# Altium schematic sheet MCUModule.SchDoc: Плата RF1-MCU
size 420 x 297 mm; ApprovedBy: Судаков; CheckedBy: Сарайкин; Author: Аршаница; CompanyName: ООО "ОКБ Вектор"; Address1: Address1; Address2: Address2; Address3: Address3; Address4: Address4; DocumentNumber: ВГАР.467846.009 Э3; SheetNumber: 1; SheetTotal: 2; Scale: 1:1; ProcessInspection: Казанов; NormInspection: Коваленко; FirstReferrence: ВГАР.467846.009
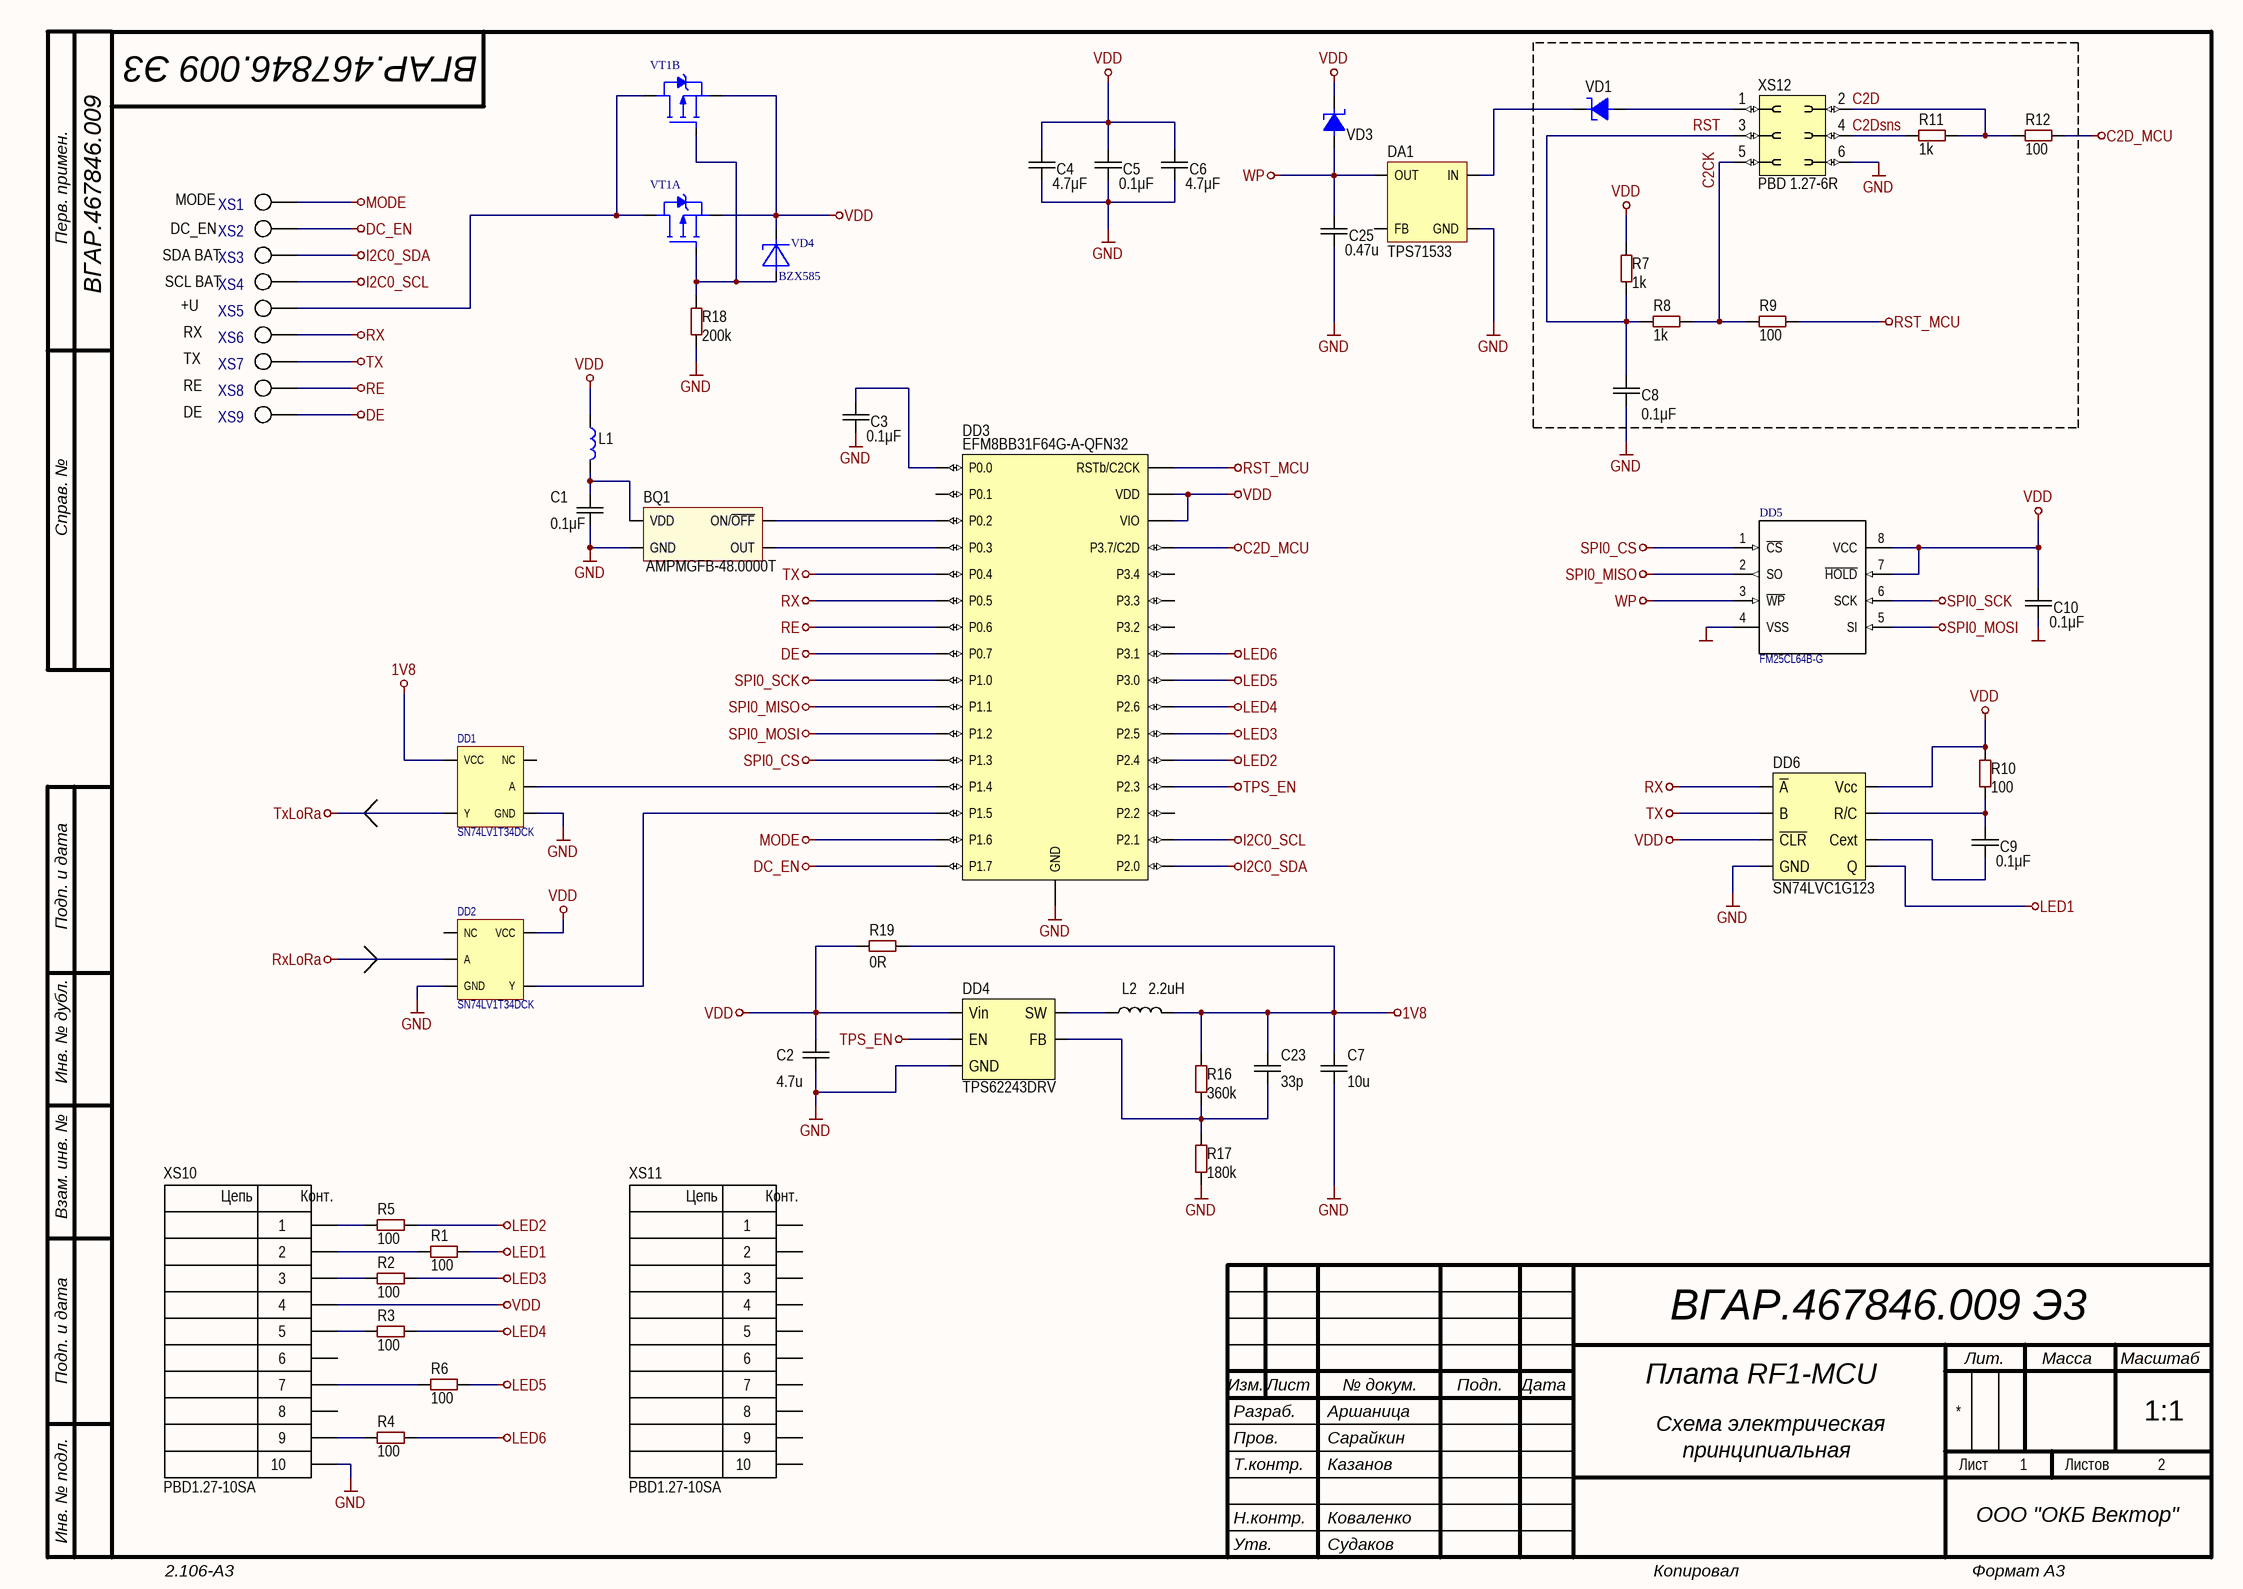
[diagram p0: MCUModule.SchDoc]

## Parts
BQ1  AMPMGFB-48.0000T  [AMPMGFB(1.6x1.2)]
C1  value 0.1μF  [CAP: 0603]
C2  value 4.7u  [CAP: 0603]
C3  value 0.1μF  [CAP: 0603]
C4  value 4.7μF  [CAP: 0603]
C5  value 0.1μF  [CAP: 0603]
C6  value 4.7μF  [CAP: 0603]
C7  value 10u  [CAP: 0603]
C8  value 0.1μF  [CAP: 0603]
C9  value 0.1μF  [CAP: 0603]
C10  value 0.1μF  [CAP: 0603]
C23  value 33p  [CAP: 0603]
C25  value 0.47u  [CAP: 0603]
DA1  TPS71533  [SC-70-5]
DD1  SN74LV1T34DCK  [SC70-5]
DD2  SN74LV1T34DCK  [SC70-5]
DD3  EFM8BB31F64G-A-QFN32  [32-QFN(4x4)]
DD4  TPS62243DRV  [SOT23-5]
DD5  FM25CL64B-G  [SO-8_N]
DD6  SN74LVC1G123  [8-VSSOP]
L1  BLM18AG102SN1D  [IND: 0603]  (value not drawn)
L2  value 2.2uH  [VLF302515MT]  (hidden comment: VLF302515MT)
R1  value 100  [RES: 0603]
R2  value 100  [RES: 0603]
R3  value 100  [RES: 0603]
R4  value 100  [RES: 0603]
R5  value 100  [RES: 0603]
R6  value 100  [RES: 0603]
R7  value 1k  [RES: 0603]
R8  value 1k  [RES: 0603]
R9  value 100  [RES: 0603]
R10  value 100  [RES: 0603]
R11  value 1k  [RES: 0603]
R12  value 100  [RES: 0603]
R16  value 360k  [RES: 0603]
R17  value 180k  [RES: 0603]
R18  value 200k  [RES: 0603]
R19  value 0R  [RES: 0402]
VD1  (no value)  [DIODE: SOD523]
VD3  (no value)  [DIODE: SOD523]
VD4  BZX585  [SOD523]
VT1  BSS84AKS  [SC-70-6]  (value not drawn)  (parts A,B of 2)
XS1  Testpoint_HS1mm  [TestPoint(without 3D)]  (value not drawn)
XS2  Testpoint_HS1mm  [TestPoint(without 3D)]  (value not drawn)
XS3  Testpoint_HS1mm  [TestPoint(without 3D)]  (value not drawn)
XS4  Testpoint_HS1mm  [TestPoint(without 3D)]  (value not drawn)
XS5  Testpoint_HS1mm  [TestPoint(without 3D)]  (value not drawn)
XS6  Testpoint_HS1mm  [TestPoint(without 3D)]  (value not drawn)
XS7  Testpoint_HS1mm  [TestPoint(without 3D)]  (value not drawn)
XS8  Testpoint_HS1mm  [TestPoint(without 3D)]  (value not drawn)
XS9  Testpoint_HS1mm  [TestPoint(without 3D)]  (value not drawn)
XS10  PBD1.27-10SA  [CON: PBD-10-1.27S]
XS11  PBD1.27-10SA  [CON: PBD-10-1.27S]
XS12  PBD 1.27-6R  [CON: PBD1.27-6]

## Nets
1V8: C7.2 C23.2 DD1.5(VCC) L2.2 R16.1 R19.2
C2D_MCU: DD3.5(P3.7/C2D) R12.1
DC_EN: DD3.18(P1.7) XS2.1
DE: DD3.26(P0.7) XS9.1
GND: BQ1.2(GND) C1.1 C2.1 C3.1 C4.1 C5.1 C6.1 C7.1 C8.1 C10.1 C25.1 DA1.2(GND) DD1.3(GND) DD2.3(GND) DD3.0(GND) DD4.2(GND) DD5.4(VSS) DD6.4(GND) R17.2 R18.2 XS10.10 XS12.6
I2C0_SCL: DD3.16(P2.1) XS4.1
I2C0_SDA: DD3.17(P2.0) XS3.1
LED1: DD6.5(Q) R1.2
LED2: DD3.13(P2.4) R5.2
LED3: DD3.12(P2.5) R2.2
LED4: DD3.11(P2.6) R3.2
LED5: DD3.10(P3.0) R6.2
LED6: DD3.9(P3.1) R4.2
MODE: DD3.19(P1.6) XS1.1
RE: DD3.27(P0.6) XS8.1
RST_MCU: DD3.4(RSTb/C2CK) R9.2
RX: DD3.28(P0.5) DD6.1(~{A}) XS6.1
RxLoRa: DD2.2(A)
SPI0_CS: DD3.22(P1.3) DD5.1(~{CS})
SPI0_MISO: DD3.24(P1.1) DD5.2(SO)
SPI0_MOSI: DD3.23(P1.2) DD5.5(SI)
SPI0_SCK: DD3.25(P1.0) DD5.6(SCK)
TPS_EN: DD3.14(P2.3) DD4.3(EN)
TX: DD3.29(P0.4) DD6.2(B) XS7.1
TxLoRa: DD1.4(Y)
VDD: C2.2 C4.2 C5.2 C6.2 C10.2 DD2.5(VCC) DD3.2(VIO) DD3.3(VDD) DD4.1(Vin) DD5.7(~{HOLD}) DD5.8(VCC) DD6.3(~{CLR}) DD6.8(Vcc) L1.1 R7.1 R10.1 R19.1 VD3.2 VD4.1(C) VT1.1(S1) VT1.4(S2) XS10.4
WP: C25.2 DA1.5(OUT) DD5.3(~{WP}) VD3.1
C2CK: R8.2 R9.1 XS12.5
C2D: R11.2 R12.2 XS12.2
C2Dsns: R11.1 XS12.4
RST: C8.2 R7.2 R8.1 XS12.3
NetBQ1_1: BQ1.1(ON/~{OFF}) DD3.31(P0.2)
NetBQ1_3: BQ1.3(OUT) DD3.30(P0.3)
NetBQ1_4: BQ1.4(VDD) C1.2 L1.2
NetC3_2: C3.2 DD3.1(P0.0)
NetC9_1: C9.1 DD6.6(Cext)
NetC9_2: C9.2 DD6.7(R/C) R10.2
NetC23_1: C23.1 DD4.4(FB) R16.2 R17.1
NetDA1_4: DA1.4(IN) VD1.2
NetDD1_2: DD1.2(A) DD3.21(P1.4)
NetDD2_4: DD2.4(Y) DD3.20(P1.5)
NetDD4_5: DD4.5(SW) L2.1
NetR1_1: R1.1 XS10.2
NetR2_1: R2.1 XS10.3
NetR3_1: R3.1 XS10.5
NetR4_1: R4.1 XS10.9
NetR5_1: R5.1 XS10.1
NetR6_1: R6.1 XS10.7
NetR18_1: R18.1 VD4.2(A) VT1.2(G1) VT1.5(G2)
NetVD1_1: VD1.1 XS12.1
NetVT1_3: VT1.3(D2) VT1.6(D1) XS5.1

Not connected (* = marked no-connect by the designer): DA1 1(FB); DD1 1(NC); DD2 1(NC); DD3 6(P3.4) 7(P3.3) 8(P3.2) 15(P2.2) 32(P0.1); XS10 6 8; XS11 1 2 3 4 5 6 7 8 9 10

## Notes on the sheet
- Рабочее подключение программатора.
  Можно портировать в другие проекты.
  На плате не правильно установлен R11.
- SDA BAT
- DC_EN
- MODE
- SCL BAT
- +U
- RX
- TX
- RE
- DE
- Схема электрическая
- принципиальная
- Перв. примен.
- Справ. №
- Подп. и дата
- Инв. № дубл.
- Взам. инв. №
- Разраб.
- Изм.
- Лист
- № докум.
- Подп.
- Дата
- Лит.
- Масса
- Масштаб
- Пров.
- Т.контр.
- Листов
- Инв. № подл.
- Утв.
- Н.контр.
- 2.106-A3
- Копировал
- Формат А3
- (in symbol PBD1.27-10SA) Цепь; Конт.

## Library data of the parts
C1 C3 C5 C8-C10 = Ceramic_0603: Manufacturer: Yageo; PartNumber: CC0603KRX7R7BB104; ValueManufacturerPartNumber: Ceramic capacitor, 0.1μF, X7R, ±10%, 16V, 0603, -55...+125°C; TypeCapacitor: Ceramic capacitor; Tolerance: ±10%; TypeDielectric: X7R; Voltage: 16V; Package: 0603; HelpURL: https://www.digikey.com/product-detail/en/yageo/CC0603KRX7R7BB104/311-1088-1-ND/302998; Temperature: -55...+125°C
C2 = Ceramic_0603: Manufacturer: Yageo; PartNumber: CC0603KRX7R7BB104; ValueManufacturerPartNumber: Ceramic capacitor, 4.7u, X7R, ±10%, 16V, 0603, -55...+125°C; TypeCapacitor: Ceramic capacitor; Tolerance: ±10%; TypeDielectric: X7R; Voltage: 16V; Package: 0603; HelpURL: https://www.digikey.com/product-detail/en/yageo/CC0603KRX7R7BB104/311-1088-1-ND/302998; Temperature: -55...+125°C
C4 C6 = Ceramic_0603: Manufacturer: Yageo; PartNumber: CC0603KRX7R7BB104; ValueManufacturerPartNumber: Ceramic capacitor, 4.7μF, X7R, ±10%, 16V, 0603, -55...+125°C; TypeCapacitor: Ceramic capacitor; Tolerance: ±10%; TypeDielectric: X7R; Voltage: 16V; Package: 0603; HelpURL: https://www.digikey.com/product-detail/en/yageo/CC0603KRX7R7BB104/311-1088-1-ND/302998; Temperature: -55...+125°C
C7 = Ceramic_0603: Manufacturer: Yageo; PartNumber: CC0603KRX7R7BB104; ValueManufacturerPartNumber: Ceramic capacitor, 10u, X7R, ±10%, 16V, 0603, -55...+125°C; TypeCapacitor: Ceramic capacitor; Tolerance: ±10%; TypeDielectric: X7R; Voltage: 16V; Package: 0603; HelpURL: https://www.digikey.com/product-detail/en/yageo/CC0603KRX7R7BB104/311-1088-1-ND/302998; Temperature: -55...+125°C
C23 = Ceramic_0603: Manufacturer: Yageo; PartNumber: CC0603KRX7R7BB104; ValueManufacturerPartNumber: Ceramic capacitor, 33p, X7R, ±10%, 16V, 0603, -55...+125°C; TypeCapacitor: Ceramic capacitor; Tolerance: ±10%; TypeDielectric: X7R; Voltage: 16V; Package: 0603; HelpURL: https://www.digikey.com/product-detail/en/yageo/CC0603KRX7R7BB104/311-1088-1-ND/302998; Temperature: -55...+125°C
C25 = Ceramic_0603: Manufacturer: Yageo; PartNumber: CC0603KRX7R7BB104; ValueManufacturerPartNumber: Ceramic capacitor, 0.47u, X7R, ±10%, 16V, 0603, -55...+125°C; TypeCapacitor: Ceramic capacitor; Tolerance: ±10%; TypeDielectric: X7R; Voltage: 16V; Package: 0603; HelpURL: https://www.digikey.com/product-detail/en/yageo/CC0603KRX7R7BB104/311-1088-1-ND/302998; Temperature: -55...+125°C
DA1 = TPS71501: Микросхема; Manufacturer: Texas Instruments; ComponentLink1Description: Data Sheet
DD1 DD2 = SN74LV1T34DCK: Single Buffer; ComponentLink1Description: Datasheet; ComponentLink1URL: https://www.ti.com/lit/ds/symlink/sn74lv1t34.pdf?ts=1607003293244&ref_url=https%253A%252F%252Fwww.ti.com%252Fproduct%252FSN74LV1T34
DD3 = EFM8BB31F64G-A-QFN32: 8051 MCU Core
DD4 = TPS62243DRV: Step-down converter 300mA
DD5 = FM25CL64B-G: Микросхема; ReplacementPart1Manufacturer: ISSI; ReplacementPart1PartNumber: IS25C08-2ZLI-TR; ComponentLink1Description: Manufacturer Link; ComponentLink1URL: http://www.microchip.com; ComponentLink2Description: Datasheet; ComponentLink3Description: Packaging Specification; PartNumber: FM25CL64B-G; Manufacturer: FM25CL64B-G
DD6 = SN74LVC1G123: Monostable Multivibrator / With Schmitt-Trigger Inputs; ComponentLink1Description: Datasheet; ComponentLink1URL: https://www.ti.com/lit/ds/symlink/sn74lvc1g123.pdf?ts=1636961729203&ref_url=https%253A%252F%252Fwww.google.com%252F
L1 = BLM18AG102SN1D: 100MHz 1K
R1-R6 R9 R10 R12 = Resistor_0603: Manufacturer: Yageo; PartNumber: RC0603JR-07100RL; ValueManufacturerPartNumber: Resistor film, 100, ±5%, 0603, 0.1W, -55...+125°C; TypeResistor: Resistor film; Power: 0.1W; Tolerance: ±5%; Package: 0603; HelpURL: https://www.digikey.com/product-detail/en/yageo/RC0603JR-07100RL/311-100GRCT-ND/729644; Temperature: -55...+125°C
R7 R8 R11 = Resistor_0603: Manufacturer: Yageo; PartNumber: RC0603JR-07100RL; ValueManufacturerPartNumber: Resistor film, 1k, ±5%, 0603, 0.1W, -55...+125°C; TypeResistor: Resistor film; Power: 0.1W; Tolerance: ±5%; Package: 0603; HelpURL: https://www.digikey.com/product-detail/en/yageo/RC0603JR-07100RL/311-100GRCT-ND/729644; Temperature: -55...+125°C
R16 = Resistor_0603: Manufacturer: Yageo; PartNumber: RC0603JR-07100RL; ValueManufacturerPartNumber: Resistor film, 360k, ±5%, 0603, 0.1W, -55...+125°C; TypeResistor: Resistor film; Power: 0.1W; Tolerance: ±5%; Package: 0603; HelpURL: https://www.digikey.com/product-detail/en/yageo/RC0603JR-07100RL/311-100GRCT-ND/729644; Temperature: -55...+125°C
R17 = Resistor_0603: Manufacturer: Yageo; PartNumber: RC0603JR-07100RL; ValueManufacturerPartNumber: Resistor film, 180k, ±5%, 0603, 0.1W, -55...+125°C; TypeResistor: Resistor film; Power: 0.1W; Tolerance: ±5%; Package: 0603; HelpURL: https://www.digikey.com/product-detail/en/yageo/RC0603JR-07100RL/311-100GRCT-ND/729644; Temperature: -55...+125°C
R18 = Resistor_0603: Manufacturer: Yageo; PartNumber: RC0603JR-07100RL; ValueManufacturerPartNumber: Resistor film, 200k, ±5%, 0603, 0.1W, -55...+125°C; TypeResistor: Resistor film; Power: 0.1W; Tolerance: ±5%; Package: 0603; HelpURL: https://www.digikey.com/product-detail/en/yageo/RC0603JR-07100RL/311-100GRCT-ND/729644; Temperature: -55...+125°C
R19 = Resistor_0402: Manufacturer: Yageo; PartNumber: RC0402JR-07100RL; ValueManufacturerPartNumber: Resistor film, 0R, ±5%, 0402, 0.063W, -55...+125°C; TypeResistor: Resistor film; Power: 0.063W; Tolerance: ±5%; Package: 0402; HelpURL: https://www.digikey.com/product-detail/en/yageo/RC0402JR-07100RL/311-100JRCT-ND/729362; Temperature: -55...+125°C
VD1 VD3 = Schottky_single: Manufacturer: Diodes Incorporated; ValueManufacturerPartNumber: Schottky diode, 80V, 500mA, 1V, 15pF, SOD-123, -55...+150°C; PartNumber: BAT54XV2; TypeDiode: Schottky diode; Voltage: 80V; Current: 500mA; VoltageDrop: 1V; RecoveryTime: 15pF; Package: SOD-123; HelpURL: https://www.digikey.com/product-detail/en/diodes-incorporated/MBR0580S1-7/MBR0580S1-7DICT-ND/5080371; Temperature: -55...+150°C
VD4 = BZX585: Стабилитрон; Manufacturer: NXP; Package: SOD-323F; ComponentLink1Description: DataSheet; ComponentLink1URL: *; Power/Voltage: *; Type: *; ComponentLink2URL: *; ComponentLink3Description: Replacement2DataSheet; ComponentLink3URL: *; ComponentLink2Description: Replacement1DataSheet; ReplacementPart2TopMarking: *; ReplacementPart1Manufacturer: *; ReplacementPart1PartNumber: *; ReplacementPart1TopMarking: *; ReplacementPart2Manufacturer: *
VT1 = BSS84AKS: Сборка транзисторная; Manufacturer: Fairchild Semiconductor; ReplacementPart1Manufacturer: ON Semiconductor; ReplacementPart1TopMarking: TK; TopMarking: .16; ComponentLink1Description: Data Sheet; ComponentLink2Description: Replacement 1 Data Sheet; ComponentLink3URL: *; PartNumber: BSS84AKS; ReplacementPart2Manufacturer: *; ReplacementPart2PartNumber: *; ReplacementPart2TopMarking: *; ComponentLink3Description: *
XS10 XS11 = PBD1.27-10SA: ComponentLink1Description: Datasheet; ComponentLink1URL: https://neokt593.ru/PBD%201.27%20-%2008SA%20PBD1.27-08SA